# EAGLE schematic Wood Lathe TinkerAccess (EAGLE 9.6.2)

## Sheet 1 of 3
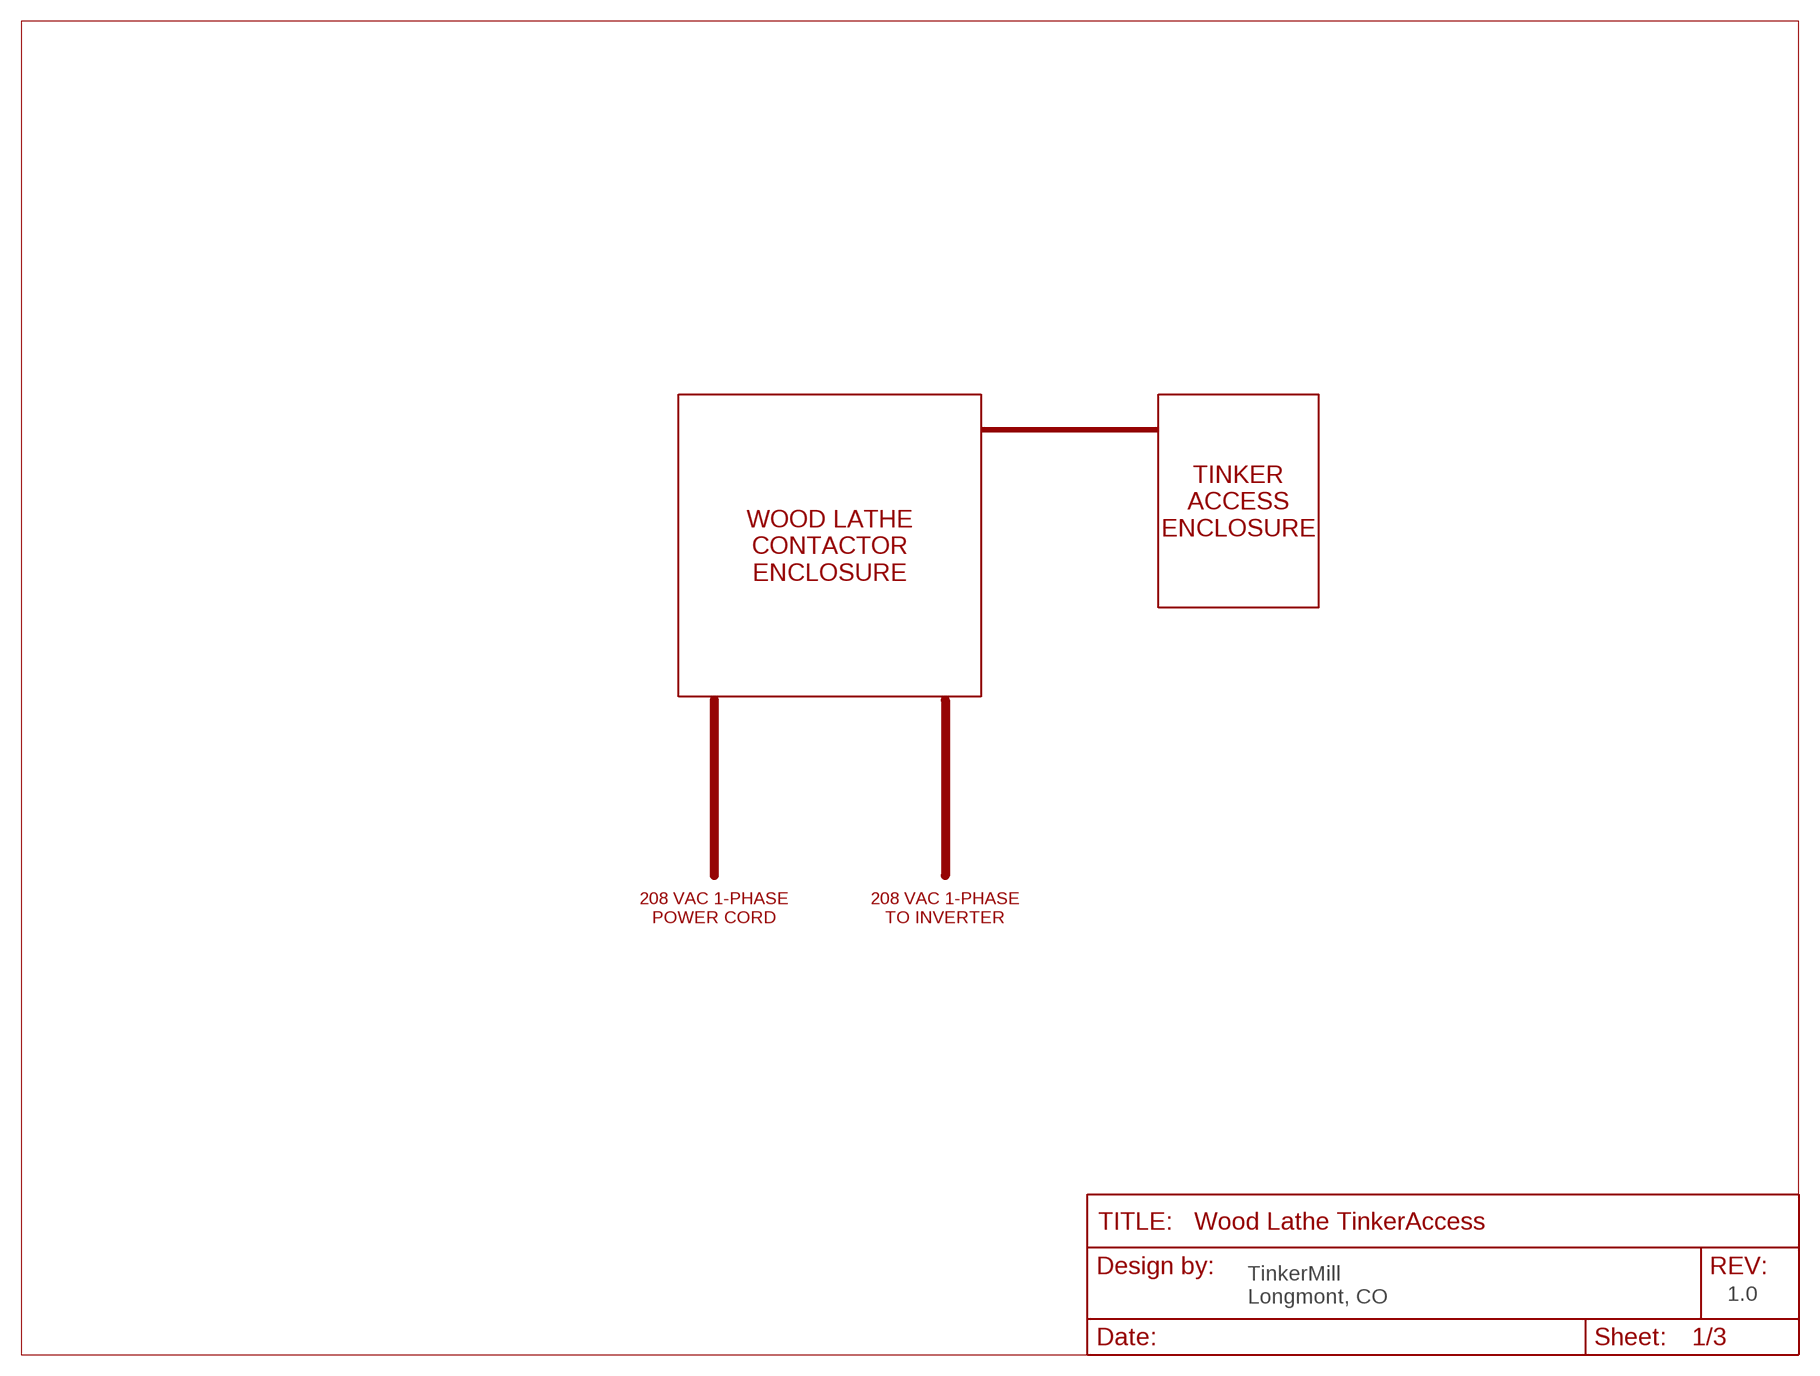
[diagram p0: schematic, sheet 1]

### Notes on the sheet
- TINKER
  ACCESS
  ENCLOSURE
- WOOD LATHE
  CONTACTOR
  ENCLOSURE
- 208 VAC 1-PHASE
  POWER CORD
- 208 VAC 1-PHASE
  TO INVERTER
- TinkerMill
  Longmont, CO
- 1.0

## Sheet 2 of 3
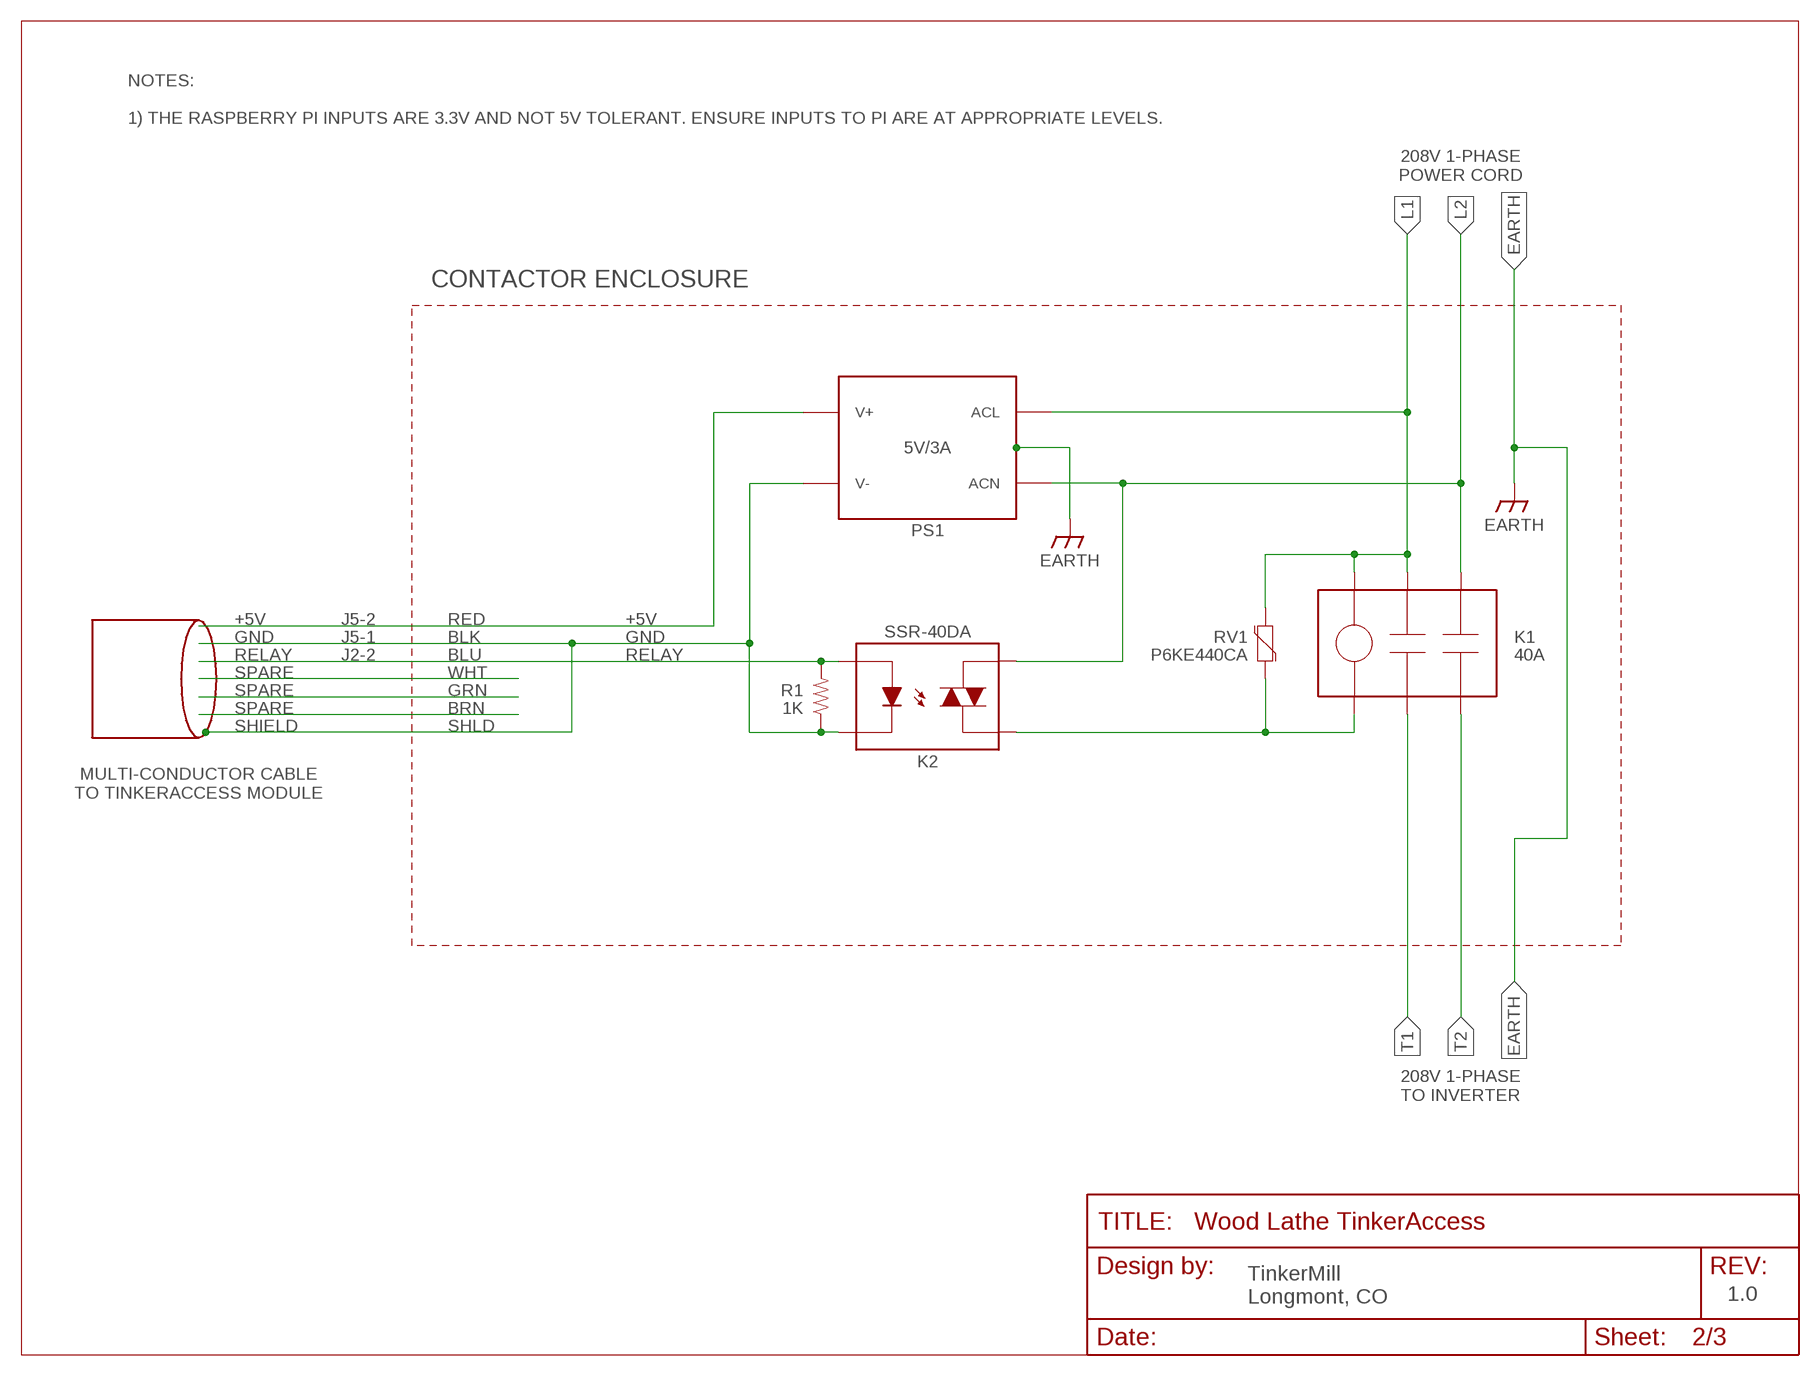
[diagram p1: schematic, sheet 2]

### Parts
K1  40A  CONTACTOR_2POLE  (no package)
K2  SSR-40DA  SOLID_STATE_RELAY  (no package)
PS1  5V/3A  POWER_SUPPLY  (no package)
R1  1K  RESISTOR_PTH_1/4W  [AXIAL_0.4]
RV1  P6KE440CA  VARISTOR_EPCOS_SK14K320  [EPCOS_14MM_DISC_5.4MM_TH]

### Nets
+5V: PS1.V+
C1: K1.A2 K2.L2 RV1.1
GND: K2.A2 PS1.V- R1.1
L1: K1.A1 K1.L1 PS1.ACL RV1.2
L2: K1.L2 K2.L1 PS1.ACN
RELAY: K2.A1 R1.2
T1: K1.T1
T2: K1.T2

### Notes on the sheet
- NOTES:
  
  1) THE RASPBERRY PI INPUTS ARE 3.3V AND NOT 5V TOLERANT. ENSURE INPUTS TO PI ARE AT APPROPRIATE LEVELS.
- 208V 1-PHASE
  POWER CORD
- CONTACTOR ENCLOSURE
- +5V | J5-2 | RED
- GND | J5-1 | BLK
- RELAY | J2-2 | BLU
- SPARE | WHT
- SPARE | GRN
- SPARE | BRN
- SHIELD | SHLD
- MULTI-CONDUCTOR CABLE
  TO TINKERACCESS MODULE
- 208V 1-PHASE
  TO INVERTER
- TinkerMill
  Longmont, CO
- 1.0

## Sheet 3 of 3
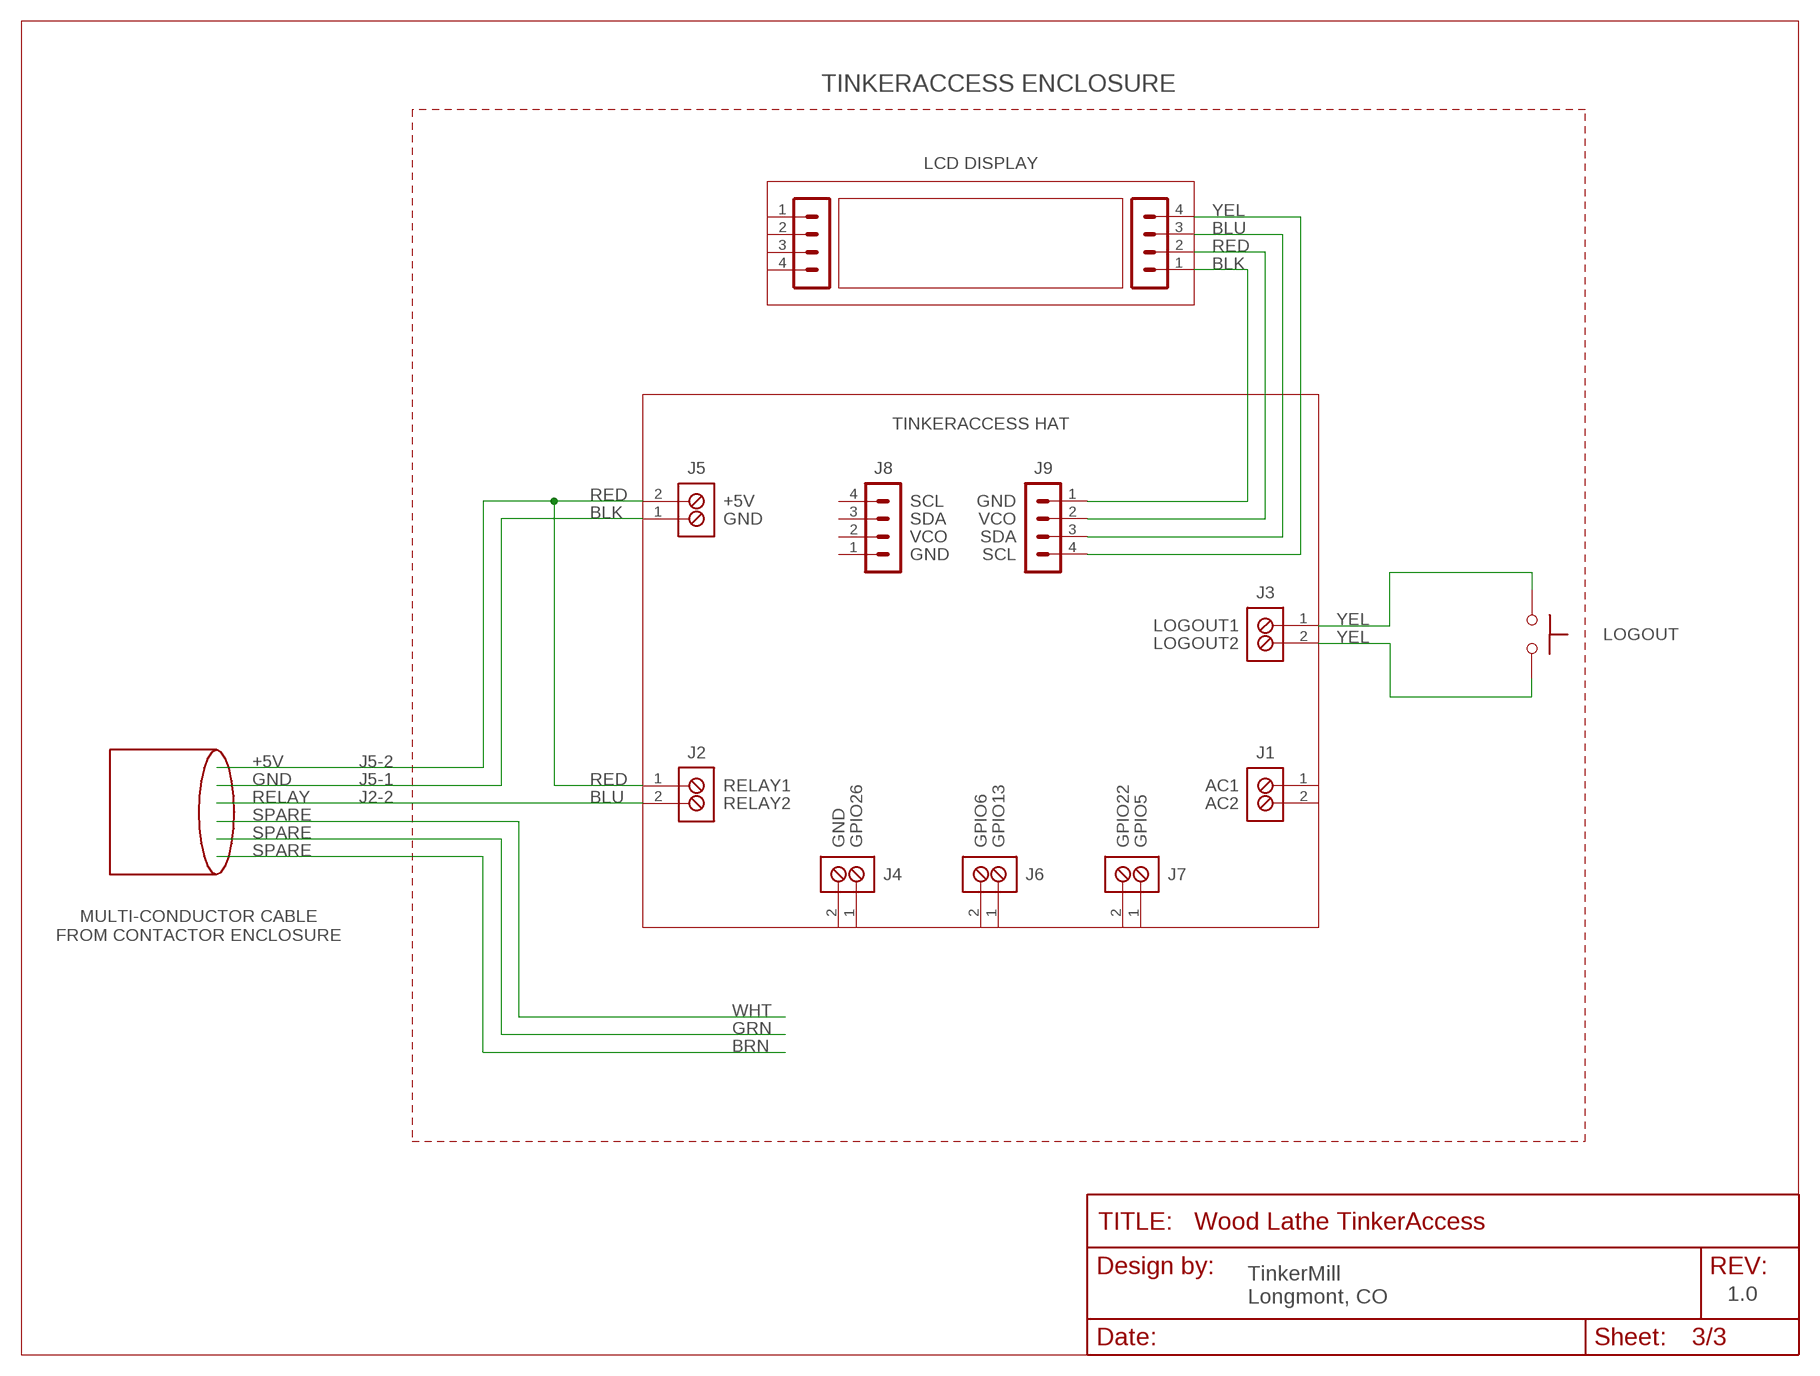
[diagram p2: schematic, sheet 3]

### Parts
J1  TB_2X1_TE_CONN_ED555_2DS  [TE_CONN_ED555_2DS]
J2  TB_2X1_TE_CONN_ED555_2DS  [TE_CONN_ED555_2DS]
J3  TB_2X1_TE_CONN_ED555_2DS  [TE_CONN_ED555_2DS]
J4  TB_2X1_TE_CONN_ED555_2DS  [TE_CONN_ED555_2DS]
J5  TB_2X1_TE_CONN_ED555_2DS  [TE_CONN_ED555_2DS]
J6  TB_2X1_TE_CONN_ED555_2DS  [TE_CONN_ED555_2DS]
J7  TB_2X1_TE_CONN_ED555_2DS  [TE_CONN_ED555_2DS]
J8  HDR_4X1_2.54MM_LOCKING_RA  [HDR_4X1_2.54MM_LOCKING_RA]
J9  HDR_4X1_2.54MM_LOCKING_RA  [HDR_4X1_2.54MM_LOCKING_RA]
J10  HDR_4X1_2.54MM_LOCKING_RA  [HDR_4X1_2.54MM_LOCKING_RA]
J11  HDR_4X1_2.54MM_LOCKING_RA  [HDR_4X1_2.54MM_LOCKING_RA]
SW3  LOGOUT  PUSHBUTTON_MOMENTARY_NO_OMRON_B3F_6MM  [OMRON_B3F_6MM]

### Nets
BLK1: J5.1
BLU1: J2.2
N$3: J3.1 SW3.1 SW3.2
N$4: J3.2 SW3.3 SW3.4
N$17: J9.1 J11.1
N$18: J9.2 J11.2
N$19: J9.3 J11.3
N$20: J9.4 J11.4
RED1: J2.1 J5.2
Unconnected: J1.1 J1.2 J4.1 J4.2 J6.1 J6.2 J7.1 J7.2 J8.1 J8.2 J8.3 J8.4 J10.1 J10.2 J10.3 J10.4

### Notes on the sheet
- TINKERACCESS ENCLOSURE
- LCD DISPLAY
- YEL
- BLU
- RED
- BLK
- TINKERACCESS HAT
- RED | +5V | SCL | GND
- BLK | GND | SDA | VCO
- VCO | SDA
- GND | SCL
- LOGOUT1 | YEL
- LOGOUT2 | YEL
- +5V | J5-2
- GND | J5-1 | RED | RELAY1 | AC1
- RELAY | J2-2 | BLU | RELAY2 | AC2
- SPARE
- SPARE
- GND | GPIO26 | GPIO6 | GPIO13 | GPIO22 | GPIO5
- SPARE
- MULTI-CONDUCTOR CABLE
  FROM CONTACTOR ENCLOSURE
- WHT
- GRN
- BRN
- TinkerMill
  Longmont, CO
- 1.0

## Library data of the parts
J1-J7 = TMF_Connectors:TB_2X1
J8-J11 = TMF_Connectors:HDR_4X1
K1 = TMF_Schematic_Only:CONTACTOR_2POLE
K2 = TMF_Schematic_Only:SOLID_STATE_RELAY
PS1 = TMF_Schematic_Only:POWER_SUPPLY
R1 = TMF_Resistors:RESISTOR
RV1 = TMF_Passives:VARISTOR
SW3 = TMF_Switches:PUSHBUTTON_MOMENTARY_NO